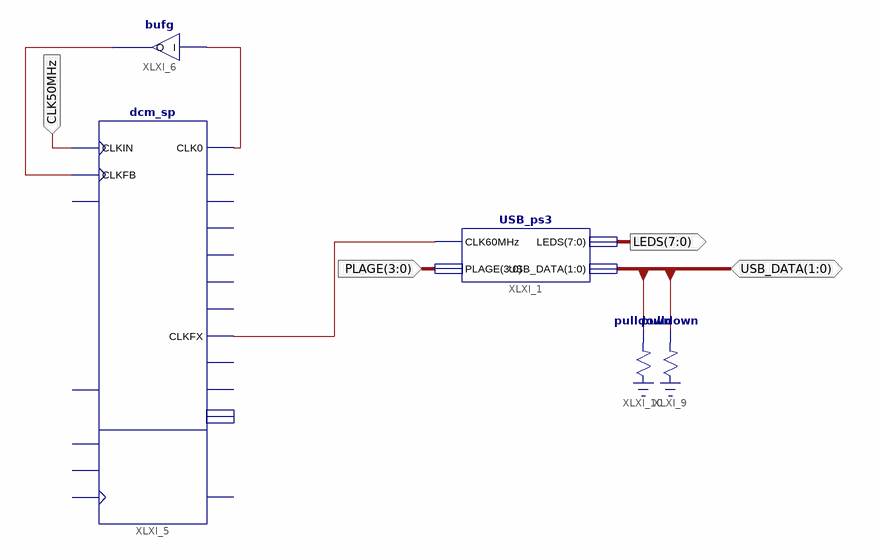
[diagram p0: schematic sheet 1]
// Xilinx ISE schematic USB_ps3_schema.sch (spartan3e) as structural Verilog: 5 symbols, 4 ports
module USB_ps3_schema (
  input  CLK50MHz,
  input  [3:0] PLAGE,
  inout  [1:0] USB_DATA,
  output [7:0] LEDS
);

  wire XLXN_1, XLXN_2, XLXN_6;

  USB_ps3 XLXI_1 (.CLK60MHz(XLXN_6), .PLAGE(PLAGE), .LEDS(LEDS), .USB_DATA(USB_DATA));
  dcm_sp #(.CLKFX_MULTIPLY(6), .CLKFX_DIVIDE(5)) XLXI_5 (
    .CLKFB(XLXN_2), .CLKIN(CLK50MHz), .CLK0(XLXN_1), .CLKFX(XLXN_6));  // open: DSSEN, PSCLK, PSEN, PSINCDEC, RST, CLK180, CLK270, CLK2X, CLK2X180, CLK90, CLKDV, CLKFX180, LOCKED, PSDONE, STATUS
  bufg XLXI_6 (.I(XLXN_1), .O(XLXN_2));
  \pulldown  XLXI_9 (.O(USB_DATA[0]));
  \pulldown  XLXI_10 (.O(USB_DATA[1]));
endmodule
